# EAGLE design Schematic_V1 (EAGLE 9.6.2)
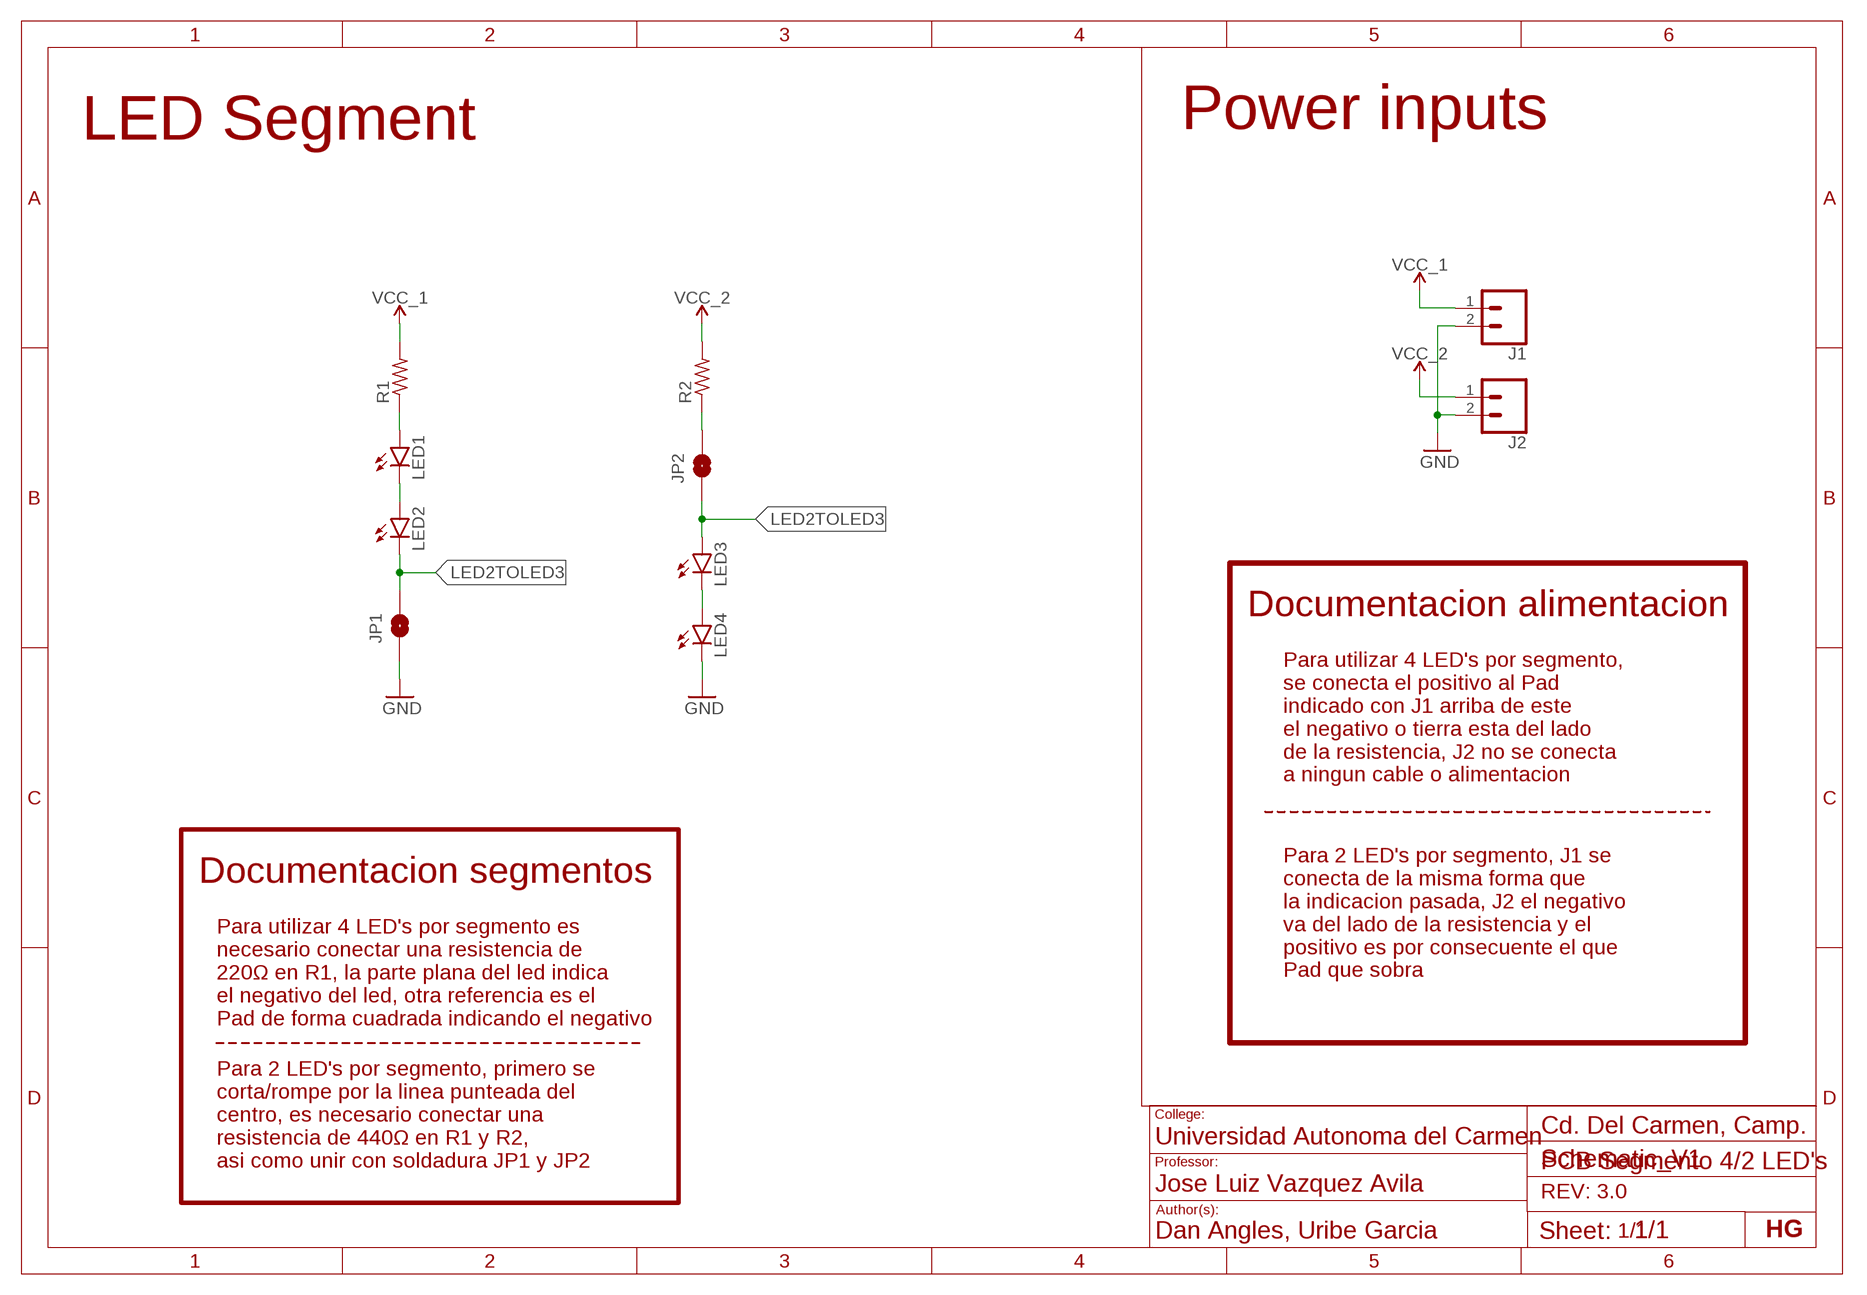
[diagram p0: schematic, sheet 1]

## Parts
J1  CONN_02LOCK  [1X02_LOCK]
J2  CONN_02LOCK  [1X02_LOCK]
JP1  JUMPER-SMT_2_NO_SILK_ROUND  [SMT-JUMPER_2_NO_SILK_ROUND]
JP2  JUMPER-SMT_2_NO_SILK_ROUND  [SMT-JUMPER_2_NO_SILK_ROUND]
LED1  LED10MM  [LED10MM]
LED2  LED10MM  [LED10MM]
LED3  LED10MM  [LED10MM]
LED4  LED10MM  [LED10MM]
R1  R-US_0411/3V  [0411V]
R2  R-US_0411/3V  [0411V]

## Nets
GND: J1.2 J2.2 JP1.1 LED4.K(C)
LED2TOLED3: JP1.2 JP2.1 LED2.K(C) LED3.A
N$1: LED1.K(C) LED2.A
N$2: LED1.A R1.1
N$3: LED3.K(C) LED4.A
N$4: JP2.2 R2.1
VCC_1: J1.1 R1.2
VCC_2: J2.1 R2.2

## Notes on the sheet
- LED Segment | Power inputs
- Documentacion alimentacion
- Para utilizar 4 LED's por segmento, 
  se conecta el positivo al Pad
  indicado con J1 arriba de este
  el negativo o tierra esta del lado
  de la resistencia, J2 no se conecta
  a ningun cable o alimentacion
- Para 2 LED's por segmento, J1 se
  conecta de la misma forma que
  la indicacion pasada, J2 el negativo
  va del lado de la resistencia y el
  positivo es por consecuente el que
  Pad que sobra
- Documentacion segmentos
- Para utilizar 4 LED's por segmento es
  necesario conectar una resistencia de
  220Ω en R1, la parte plana del led indica
  el negativo del led, otra referencia es el
  Pad de forma cuadrada indicando el negativo
- Para 2 LED's por segmento, primero se 
  corta/rompe por la linea punteada del 
  centro, es necesario conectar una
  resistencia de 440Ω en R1 y R2,
  asi como unir con soldadura JP1 y JP2
- College:
- Cd. Del Carmen, Camp.
- Universidad Autonoma del Carmen
- Professor: | PCB Segmento 4/2 LED's
- Jose Luiz Vazquez Avila
- REV: 3.0
- Author(s):
- Dan Angles, Uribe Garcia | 1/1 | HG

## Library data of the parts
J1 J2 = SparkFun-Connectors:CONN_02: Multi connection point. Often used as Generic Header-pin footprint for 0.1 inch spaced/style header connections On any of the 0.1 inch spaced packages, you can populate with these: Break Away Headers - Straight <https://www.sparkfun.com/products/116> (PRT-00116) Break Away Male Headers - Right Angle <https://www.sparkfun.com/products/553> (PRT-00553) Female Headers <https://www.sparkfun.com/products/115> (PRT-00115) Break Away Headers - Machine Pin <https://www.sparkfun.com/products/117> (PRT-00117) Break Away Female Headers - Swiss Machine Pin <https://www.sparkfun.com/products/743> (PRT-00743) For SCREWTERMINALS and SPRING TERMINALS visit here: Screw Terimnals on SparkFun.com <https://www.sparkfun.com/search/results?term=Screw+Terminals> (5mm/3.5mm/2.54mm spacing) This device is also useful as a general connection point to wire up your design to another part of your project. Our various solder wires solder well into these plated through hole pads. Hook-Up Wire - Assortment (Stranded, 22 AWG) <https://www.sparkfun.com/products/11375> (PRT-11375) Hook-Up Wire - Assortment (Solid Core, 22 AWG) <https://www.sparkfun.com/products/11367> (PRT-11367) View the entire wire category on our website here <https://www.sparkfun.com/categories/141> Special notes: Molex polarized connector foot print use with: PRT-08233 with associated crimp pins and housings. 2.54_SCREWTERM for use with PRT-10571. 3.5mm Screw Terminal footprints for PRT-08084 5mm Screw Terminal footprints for use with PRT-08432
JP1 JP2 = SparkFun-Jumpers:JUMPER-SMT_2_NO: Normally open jumper This jumper has two pads in close proximity to each other. Apply solder to close the connection. Round pads are easier to solder for beginners, but are a lot larger. SparkFun Product that uses the round pads: SparkFun EL Sequencer <https://www.sparkfun.com/products/12781>
LED1-LED4 = led:LED: LED OSRAM: - CHIPLED LG R971, LG N971, LY N971, LG Q971, LY Q971, LO R971, LY R971 LH N974, LH R974 LS Q976, LO Q976, LY Q976 LO Q996 - Hyper CHIPLED LW Q18S LB Q993, LB Q99A, LB R99A - SideLED LS A670, LO A670, LY A670, LG A670, LP A670 LB A673, LV A673, LT A673, LW A673 LH A674 LY A675 LS A676, LA A676, LO A676, LY A676, LW A676 LS A679, LY A679, LG A679 - Hyper Micro SIDELED® LS Y876, LA Y876, LO Y876, LY Y876 LT Y87S - SmartLED LW L88C, LW L88S LB L89C, LB L89S, LG L890 LS L89K, LO L89K, LY L89K LS L896, LA L896, LO L896, LY L896 - TOPLED LS T670, LO T670, LY T670, LG T670, LP T670 LSG T670, LSP T670, LSY T670, LOP T670, LYG T670 LG T671, LOG T671, LSG T671 LB T673, LV T673, LT T673, LW T673 LH T674 LS T676, LA T676, LO T676, LY T676, LB T676, LH T676, LSB T676, LW T676 LB T67C, LV T67C, LT T67C, LS T67K, LO T67K, LY T67K, LW E67C LS E67B, LA E67B, LO E67B, LY E67B, LB E67C, LV E67C, LT E67C LW T67C LS T679, LY T679, LG T679 LS T770, LO T770, LY T770, LG T770, LP T770 LB T773, LV T773, LT T773, LW T773 LH T774 LS E675, LA E675, LY E675, LS T675 LS T776, LA T776, LO T776, LY T776, LB T776 LHGB T686 LT T68C, LB T68C - Hyper Mini TOPLED® LB M676 - Mini TOPLED Santana® LG M470 LS M47K, LO M47K, LY M47K Source: http://www.osram.convergy.de LUXEON: - LUMILED® LXK2-PW12-R00, LXK2-PW12-S00, LXK2-PW14-U00, LXK2-PW14-V00 LXK2-PM12-R00, LXK2-PM12-S00, LXK2-PM14-U00 LXK2-PE12-Q00, LXK2-PE12-R00, LXK2-PE12-S00, LXK2-PE14-T00, LXK2-PE14-U00 LXK2-PB12-K00, LXK2-PB12-L00, LXK2-PB12-M00, LXK2-PB14-N00, LXK2-PB14-P00, LXK2-PB14-Q00 LXK2-PR12-L00, LXK2-PR12-M00, LXK2-PR14-Q00, LXK2-PR14-R00 LXK2-PD12-Q00, LXK2-PD12-R00, LXK2-PD12-S00 LXK2-PH12-R00, LXK2-PH12-S00 LXK2-PL12-P00, LXK2-PL12-Q00, LXK2-PL12-R00 Source: www.luxeon.com KINGBRIGHT: KA-3528ASYC Source: www.kingbright.com
R1 R2 = resistor:R-US_: RESISTOR, American symbol

## Board
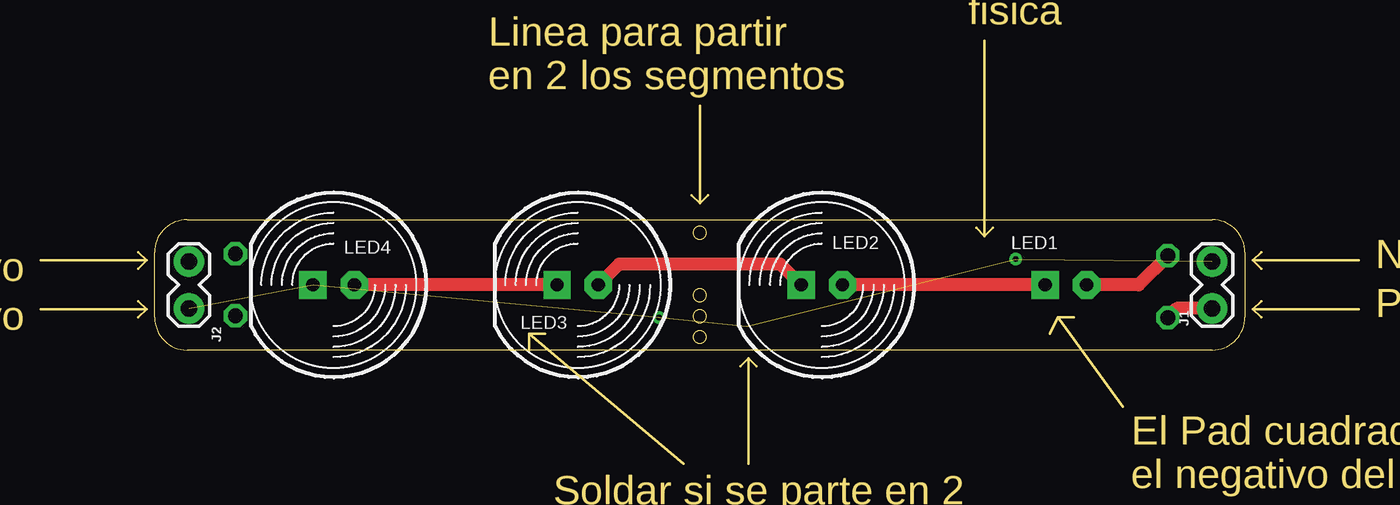
[diagram p1: board, top side]
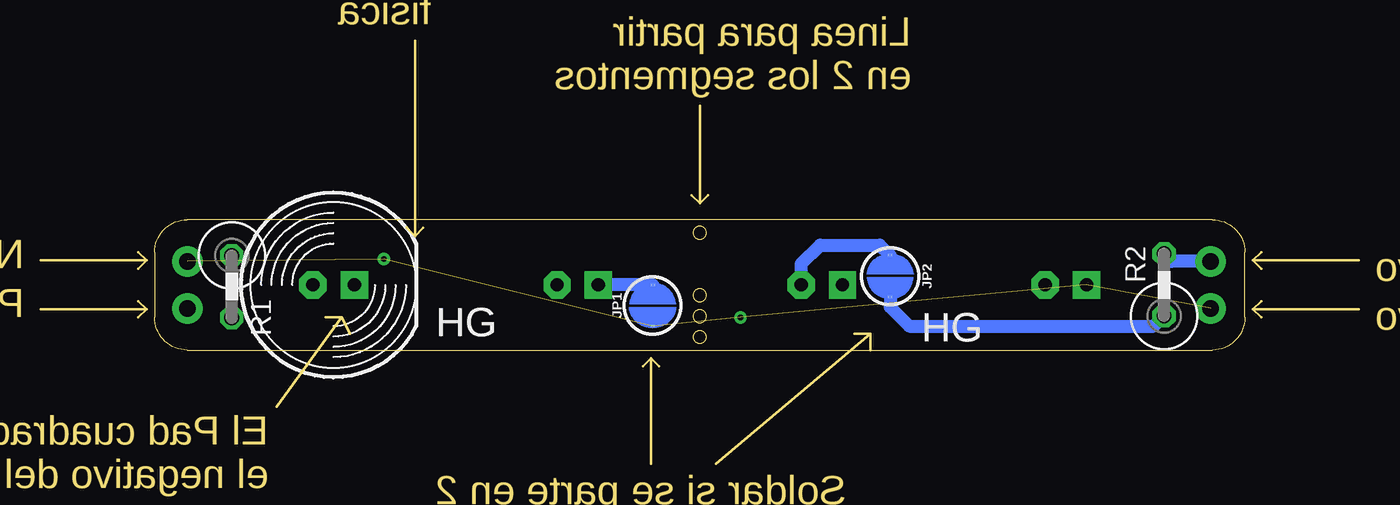
[diagram p2: board, bottom side, seen from below]

Size 81 x 26 mm. Coordinates in mm from the lower left corner, seen from the top.
Outline: 30,7 72,7 arc90 74,9 74,13 arc90 72,15 9,15 arc90 7,13 7,9 arc90 9,7 30,7
Outline: 40.5,16 40.5,22
Outline: 40,16.5 40.5,16
Outline: 40.5,16 41,16.5
Outline: 74.5,12.5 81,12.5
Outline: 75,13 74.5,12.5
Outline: 75,12 74.5,12.5
Outline: 74.5,9.5 81,9.5
Outline: 75,10 74.5,9.5
Outline: 75,9 74.5,9.5
Outline: 6.5,9.5 0,9.5
Outline: 6,9 6.5,9.5
Outline: 6,10 6.5,9.5
Outline: 6.5,12.5 0,12.5
Outline: 6,12 6.5,12.5
Outline: 6,13 6.5,12.5
Outline: 58,14 58,26
Outline: 57.5,14.5 58,14
Outline: 58,14 58.5,14.5
Outline: 43.5,6.5 43.5,0
Outline: 43.5,6.5 43,6
Outline: 43.5,6.5 44,6
Outline: 30,7 30,8
Outline: 31,8 30,8
Outline: 30,8 39.5,0
Outline: 62,8 62.5,9
Outline: 62.5,9 63.5,9
Outline: 62.5,9 66.5,3.5
Outline: circle at 40.5,7.8 radius 0.4
Outline: circle at 40.5,9.08 radius 0.4
Outline: circle at 40.5,10.36 radius 0.4
Outline: circle at 40.5,14.2 radius 0.4
Copper layers (1*16): Top 0.035mm / dielectric 1.5mm / Bottom 0.035mm
Design rules "default": minimum track width 6mil, minimum drill 0.35mm, track to track 6mil, track to pad 6mil, pad to pad 6mil, via to via 6mil, smd to smd 6mil, copper to edge 40mil, drill to drill 6mil, minimum pad ring 10mil, minimum via ring 8mil, stop-mask expansion 4mil, vias tented up to drill 0mil, thermal gap 10mil

### Footprints (pad centres in the part's own frame; a part is rotated, then mirrored left to right if it is on the bottom)
1X02_LOCK = drill 1.016 pad 1.88: 1 -0.178,0; 2 2.718,0
SMT-JUMPER_2_NO_SILK_ROUND = smd 0.152 x 0.305: 1 -1.27,0; 2 1.27,0
LED10MM = drill 0.813 pad 1.676 octagon: A -1.27,0 | drill 0.813 pad 1.676 square: K 1.27,0
0411V = drill 0.914 octagon: 1 -2.54,0; 2 1.27,0

### Placement (x,y rotation side)
J1  71.97,9.73 90 top
J2  9.11,12.27 270 top
JP1  43.4,9.73 90 bottom
JP2  28.8,11.54 270 bottom
LED1  63,11 0 bottom
LED2  48,11 180 top
LED3  33,11 180 top
LED4  18,11 180 top
R1  69.25,10.26 270 bottom
R2  11.97,11.63 90 bottom

### Tracks (layer width: path | path; a pad name or v marks a point on that pad's centre or on a via)
GND  (via drill 0.35)  (5 unrouted)
  other vias: 38,9 59.91,12.59
LED2TOLED3
  Top 0.813: LED2.K 45.46,12.27 35.54,12.27 LED3.A
  Bottom 0.813: JP1.2 LED2.K | JP2.1 29.43,13.45 33.09,13.45 34.27,12.27 LED3.A
N$1
  Top 0.813: LED1.K LED2.A
N$2
  Top 0.813: R1.1 67.45,11 LED1.A
N$3
  Top 0.813: LED3.K LED4.A
N$4
  Bottom 0.813: R2.1 12.6,8.46 27.62,8.46 28.8,9.63 JP2.2
VCC_1
  Top 0.813: J1.1 69.82,9.55 R1.2
VCC_2
  Bottom 0.813: J2.1 11.51,12.45 R2.2

### Text on the board
Dimension: La linea plana indica el / negativo del LED, cada LED / tiene una linea asi de manera / fisica | Linea para partir / en 2 los segmentos | Positivo | Negativo | Negativo | Positivo | El Pad cuadrado indica / el negativo del LED | Soldar si se parte en 2
bPlace: HG | HG
bNames: HG | HG